# Altium schematic sheet 5VBoost.SchDoc
size A; SheetNumber: 2; SheetTotal: 4
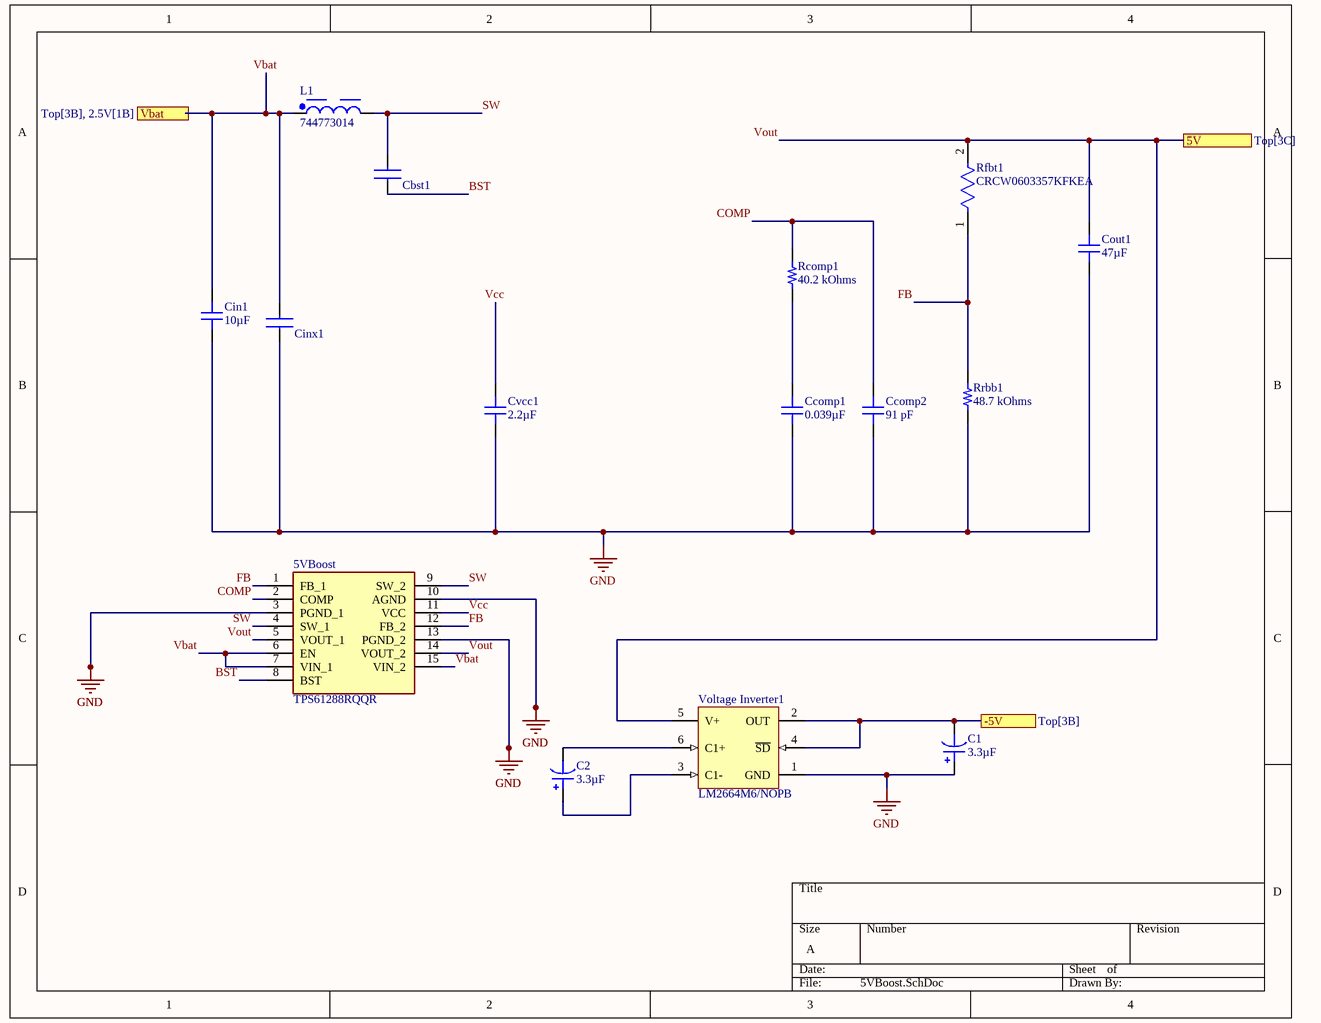
[diagram p0: 5VBoost.SchDoc]

## Parts
5VBoost  TPS61288RQQR  [TPS61288RQQR]
C1  value 3.3µF  [CAP POL 1411_3528]  (hidden comment: SCTB335K16)
C2  value 3.3µF  [CAP POL 1411_3528]  (hidden comment: SCTB335K16)
Cbst1  Capacitor 100nF 0603  [CAPC1608X90N]  (value not drawn)
Ccomp1  value 0.039µF  [CAP 0603_1608]  (hidden comment: 06035C393JAT2A)
Ccomp2  value 91 pF  [CAP 0603_1608]  (hidden comment: C0603C910J1GAC7867)
Cin1  value 10µF  [CAP 0603_1608]  (hidden comment: 06036D106KAT2A)
Cinx1  Capacitor 100nF 0603  [CAPC1608X90N]  (value not drawn)
Cout1  value 47µF  [CAP 0603_1608]  (hidden comment: 06036D476MAT2A)
Cvcc1  value 2.2µF  [CAP 0603_1608]  (hidden comment: 0603YD225KAT2A)
L1  744773014  [WE-PD2_4532]
Rcomp1  value 40.2 kOhms  [RES 0603_1608]  (hidden comment: RT0603DRE0740K2L)
Rfbt1  CRCW0603357KFKEA  [FP-CRCW0603-e3-IPC_C]
Rrbb1  value 48.7 kOhms  [RES 0603_1608]  (hidden comment: CPF0603F48K7C1)
Voltage_Inverter1  LM2664M6/NOPB  [DBV0006A_L]

## Ports
5V (see Top[3C]), -5V (see Top[3B]), Vbat (in, see Top[3B], 2.5V[1B])

## Nets
GND: 5VBoost.3(PGND_1) 5VBoost.10(AGND) 5VBoost.13(PGND_2) C1.1 Ccomp1.1 Ccomp2.1 Cin1.1 Cinx1.1 Cout1.1 Cvcc1.1 Rrbb1.1 Voltage_Inverter1.1(GND)
-5V: C1.2 Voltage_Inverter1.2(OUT) Voltage_Inverter1.4(~{SD}) ; port -5V
BST: 5VBoost.8(BST) Cbst1.1
COMP: 5VBoost.2(COMP) Ccomp2.2 Rcomp1.2
FB: 5VBoost.1(FB_1) 5VBoost.12(FB_2) Rfbt1.1 Rrbb1.2
SW: 5VBoost.4(SW_1) 5VBoost.9(SW_2) Cbst1.2 L1.2
Vbat: 5VBoost.6(EN) 5VBoost.7(VIN_1) 5VBoost.15(VIN_2) Cin1.2 Cinx1.2 L1.1 ; port Vbat
Vcc: 5VBoost.11(VCC) Cvcc1.2
Vout: 5VBoost.5(VOUT_1) 5VBoost.14(VOUT_2) Cout1.2 Rfbt1.2 Voltage_Inverter1.5(V+) ; port 5V
NetC2_1: C2.1 Voltage_Inverter1.3(C1-)
NetC2_2: C2.2 Voltage_Inverter1.6(C1+)
NetCcomp1_2: Ccomp1.2 Rcomp1.1

## Library data of the parts
5VBoost = TPS61288RQQR: Integrated Circuit; Manufacturer_Name: Texas Instruments; Datasheet Link: https://www.ti.com/lit/ds/symlink/tps61288.pdf?ts=1609351344517&ref_url=https%253A%252F%252Fwww.ti.com%252Fpower-management%252Fnon-isolated-dc-dc-switching-regulators%252Fstep-up-boost%252Fboost-converters-integrated-switch%252Fproducts.html; Height: 1mm; Manufacturer_Part_Number: TPS61288RQQR; Mouser Part Number: 595-TPS61288RQQR; Mouser Price/Stock: https://www.mouser.co.uk/ProductDetail/Texas-Instruments/TPS61288RQQR?qs=eP2BKZSCXI7ZX8saYJkaIw%3D%3D; Arrow Part Number: TPS61288RQQR; Arrow Price/Stock: https://www.arrow.com/en/products/tps61288rqqr/texas-instruments?utm_currency=USD&region=nac
C1 C2 = CMP-192-003656-1: CAP-TANT SM 3.3UF 16V; Manufacturer Size Code: B; manufacturer: NTE Electronics, Inc; Tolerance: ±10%; Type: Molded; series: SCT; Size / Dimension: 0.138" L x 0.110" W (3.50mm x 2.80mm); ComponentLink2URL: http://digikey.com/product-detail/en/nte-electronics-inc/SCTB335K16/2368-SCTB335K16-ND/11646299; lastupdated: 8/30/2020 8:55:00 PM; Features: General Purpose; price: 0.56; Mounting Type: Surface Mount; packaging: Bag; ComponentLink1URL: https://www.nteinc.com/capacitor_web/pdf/sct.pdf; partid: 3657; Minimum Order: 5; Height - Seated (Max): 0.083" (2.10mm); ComponentLink2Description: DigiKey Link; Package / Case: 1411 (3528 Metric), 1210; Part Number: SCTB335K16; Lifecycle Status: Active; ComponentLink1Description: Datasheet; Capacitance: 3.3µF
Cbst1 Cinx1 = CMP-002-000221-3: TDK - CGA3E2X7R1H104K080AA Multilayer Ceramic Capacitors MLCC - SMD/SMT CGA 0603 50V 0.1uF X7R 10% AEC-Q200; Manufacturer_Name: TDK; Datasheet Link: https://componentsearchengine.com//CGA3E2X7R1H104K080AA.pdf; Manufacturer_Part_Number: CGA3E2X7R1H104K080AA; Design Item ID: CGA3E2X7R1H104K080AA; Height: 0.9mm; Source: CGA3E2X7R1H104K080AA.SchLib; Mouser2 Price/Stock: https://www.mouser.com/Search/Refine.aspx?Keyword=810-CGA3E2X7R1H104K; Mouser2 Part Number: 810-CGA3E2X7R1H104K
Ccomp1 = CMP-184-000491-1: CAP CER 0.039UF 50V X7R 0603; manufacturer: AVX Corporation; Tolerance: ±5%; lastupdated: 9/2/2020 1:03:32 AM; Size / Dimension: 0.063" L x 0.032" W (1.60mm x 0.81mm); Part Status: Active; Lifecycle Status: Active; Package / Case: 0603 (1608 Metric); Voltage - Rated: 50V; ComponentLink2Description: DigiKey Link; Part Number: 06035C393JAT2A; ComponentLink2URL: http://digikey.com/product-detail/en/avx-corporation/06035C393JAT2A/478-10354-1-ND/6797293; Capacitance: 0.039µF; Device Package: 0603 (1608 Metric); Temperature Coefficient: X7R; Applications: General Purpose; partid: 4146; series: -; ComponentLink1URL: http://datasheets.avx.com/X7RDielectric.pdf; packaging: TapeAndReel; ComponentLink1Description: Datasheet; Operating Temperature: -55°C ~ 125°C; Thickness (Max): 0.035" (0.90mm); Minimum Order: 1; price: 0.08; Mounting Type: Surface Mount, MLCC
Ccomp2 = CMP-184-001276-1: CAP CER 91PF 100V C0G/NP0 0603; manufacturer: KEMET; Tolerance: ±5%; Temperature Coefficient: C0G, NP0; Lifecycle Status: Active; ComponentLink2URL: https://www.digikey.com/en/products/detail/kemet/C0603C910J1GAC7867/7382113; Mounting Type: Surface Mount, MLCC; ComponentLink2Description: DigiKey Link; Package / Case: 0603 (1608 Metric); series: SMD Comm C0G; ComponentLink1URL: https://api.kemet.com/component-edge/download/datasheet/C0603C910J1GAC7867.pdf; Part Status: Active; partid: 7603; price: 0.06; Minimum Order: 1; lastupdated: 9/19/2022 1:01:05 PM; Part Number: C0603C910J1GAC7867; Voltage - Rated: 100V; Size / Dimension: 0.063" L x 0.031" W (1.60mm x 0.80mm); Features: Low ESL; packaging: TapeAndReel; Capacitance: 91 pF; ComponentLink1Description: Datasheet; Operating Temperature: -55°C ~ 125°C; Applications: General Purpose; Device Package: 0603 (1608 Metric); Thickness (Max): 0.034" (0.87mm)
Cin1 = CMP-184-001573-1: CAP CER 10UF 6.3V X5R 0603; manufacturer: AVX Corporation; Tolerance: ±10%; Part Number: 06036D106KAT2A; lastupdated: 9/2/2020 1:03:24 AM; Voltage - Rated: 6.3V; Part Status: Active; price: 0.45; ComponentLink2URL: http://digikey.com/product-detail/en/avx-corporation/06036D106KAT2A/478-7932-1-ND/3881555; Size / Dimension: 0.063" L x 0.032" W (1.60mm x 0.81mm); ComponentLink1URL: http://datasheets.avx.com/cx5r.pdf; packaging: TapeAndReel; Device Package: 0603 (1608 Metric); partid: 8872; Thickness (Max): 0.035" (0.90mm); series: -; Minimum Order: 1; ComponentLink2Description: DigiKey Link; Capacitance: 10µF; Operating Temperature: -55°C ~ 85°C; Temperature Coefficient: X5R; Package / Case: 0603 (1608 Metric); Applications: General Purpose; ComponentLink1Description: Datasheet; Lifecycle Status: Active; Mounting Type: Surface Mount, MLCC
Cout1 = CMP-184-002058-1: CAP CER 47UF 6.3V X5R 0603; manufacturer: AVX Corporation; Tolerance: ±20%; Part Status: Active; Mounting Type: Surface Mount, MLCC; Minimum Order: 1; packaging: TapeAndReel; ComponentLink2URL: http://digikey.com/product-detail/en/avx-corporation/06036D476MAT2A/478-11180-1-ND/7563130; price: 0.41; lastupdated: 9/2/2020 1:03:20 AM; ComponentLink1URL: http://datasheets.avx.com/cx5r.pdf; Device Package: 0603 (1608 Metric); Voltage - Rated: 6.3V; series: -; ComponentLink2Description: DigiKey Link; ComponentLink1Description: Datasheet; partid: 11014; Size / Dimension: 0.063" L x 0.031" W (1.60mm x 0.80mm); Applications: General Purpose; Temperature Coefficient: X5R; Capacitance: 47µF; Operating Temperature: -55°C ~ 85°C; Part Number: 06036D476MAT2A; Package / Case: 0603 (1608 Metric); Lifecycle Status: Active
Cvcc1 = CMP-184-002158-1: CAP CER 2.2UF 16V X5R 0603; manufacturer: AVX Corporation; Tolerance: ±10%; Device Package: 0603 (1608 Metric); Package / Case: 0603 (1608 Metric); series: -; price: 0.19; Operating Temperature: -55°C ~ 85°C; Part Status: Active; Lifecycle Status: Active; packaging: TapeAndReel; Minimum Order: 1; ComponentLink2Description: DigiKey Link; Voltage - Rated: 16V; Part Number: 0603YD225KAT2A; ComponentLink1Description: Datasheet; partid: 11466; Applications: General Purpose; ComponentLink2URL: http://digikey.com/product-detail/en/avx-corporation/0603YD225KAT2A/478-5147-1-ND/1913237; Mounting Type: Surface Mount, MLCC; Temperature Coefficient: X5R; lastupdated: 9/2/2020 1:03:19 AM; ComponentLink1URL: http://datasheets.avx.com/cx5r.pdf; Thickness (Max): 0.035" (0.90mm); Capacitance: 2.2µF; Size / Dimension: 0.063" L x 0.032" W (1.60mm x 0.81mm)
L1 = CMP-0227-00478-2: NexarPartId: 24533326; Self Resonant Frequency: 103MHz; Inductance: 1.4µH; DC Resistance (DCR): 22mΩ; RMS Current (Irms): 3.4A; Inductance Tolerance: 20%; Saturation Current: 5.04A; Core Material: Ferrite; Test Frequency: 10kHz; Resistance: 56mΩ; Shielding: Unshielded; Min Operating Temperature: -40°C; Length: 4mm; Ambient Temperature Range Low: -40°C; Lead Free: Lead Free; Ambient Temperature Range High: 85°C; Case/Package: Nonstandard; REACH SVHC: Unknown; Width: 4.5mm; Max Operating Temperature: 125°C; Height: 3.2mm; Height - Seated (Max): 3.5052mm; RoHS: Compliant; Mount: Surface Mount; Tolerance: 20%; Composition: Wirewound; Current Rating: 3.4A; Max DC Current: 3.4A; Termination: SMD/SMT; Packaging: Digi-Reel®
Rcomp1 = CMP-289-002489-1: RES SMD 40.2KOHM 0.5% 1/10W 0603; Manufacturer: Yageo; Power (Watts): 0.1W, 1/10W; Temperature Coefficient: ±50ppm/°C; Supplier Device Package: 0603; Height - Seated (Max): 0.022" (0.55mm); Composition: Thin Film; Size / Dimension: 0.063" L x 0.031" W (1.60mm x 0.80mm); Packaging: TapeAndReel; Series: RT; Resistance: 40.2 kOhms; Minimum Order: 1; PartId: 9988; ComponentLink1URL: https://www.yageo.com/upload/media/product/productsearch/datasheet/rchip/PYu-RT_1-to-0.01_RoHS_L_11.pdf; Number of Terminations: 2; Part Number: RT0603DRE0740K2L; Device Package: 0603 (1608 Metric); Price: 0.01; Operating Temperature: -55°C ~ 155°C; ComponentLink2Description: DigiKey Link; Tolerance: ±0.5%; Part Status: Active; ComponentLink2URL: https://www.digikey.com/en/products/detail/yageo/RT0603DRE0740K2L/1074850; LastUpdated: 9/19/2022 1:22:15 PM; Lifecycle Status: Active; ComponentLink1Description: Datasheet; Package / Case: 0603 (1608 Metric)
Rfbt1 = CMP-2000-03262-2: RES Thick Film, 357kΩ, 1%, 0.1W, 100ppm/°C, 0603; Max Power Dissipation: 100mW; Voltage Rating (DC): 75V; Resistance: 357kR; Packaging: Tape and Reel; Min Operating Temperature: -55°C; Max Operating Temperature: 155°C; Number of Pins: 2; Length: 1.55mm; Case Code (Imperial): 0603; Number of Terminations: 2; Military Standard: Not; Width: 0.033inch; Case Code (Metric): 1608; Termination: Solder; Radiation Hardening: No; Power Rating: 100mW; Depth: 0.85mm; Voltage Rating: 75V; Height: 0.45mm; Case/Package: 0603; Package Quantity: 10; Composition: Thick Film; Weight: 7.1E-05oz; Features: Automotive AEC-Q200; Lead Free: Lead Free; Tolerance: 1%; Temperature Coefficient: 100ppm/°C; Contact Plating: Tin
Rrbb1 = CMP-289-001065-1: RES SMD 48.7K OHM 1% 1/16W 0603; Manufacturer: TE Connectivity Passive Product; Temperature Coefficient: ±50ppm/°C; Power (Watts): 0.063W, 1/16W; ComponentLink2Description: DigiKey Link; ComponentLink1Description: Datasheet; Tolerance: ±1%; PartId: 7053; Composition: Thin Film; Size / Dimension: 0.061" L x 0.031" W (1.55mm x 0.80mm); Operating Temperature: -55°C ~ 155°C; LastUpdated: 9/19/2022 1:22:26 PM; Part Number: CPF0603F48K7C1; Resistance: 48.7 kOhms; Price: 0.02; Part Status: Active; Height - Seated (Max): 0.022" (0.55mm); Device Package: 0603 (1608 Metric); Series: CPF, Neohm; Package / Case: 0603 (1608 Metric); Number of Terminations: 2; Minimum Order: 1; Lifecycle Status: Active; Packaging: TapeAndReel; Supplier Device Package: 0603; ComponentLink2URL: https://www.digikey.com/en/products/detail/te-connectivity-passive-product/CPF0603F48K7C1/2384648; ComponentLink1URL: https://www.te.com/commerce/DocumentDelivery/DDEController?Action=srchrtrv&DocNm=1773200&DocType=DS&DocLang=English
Voltage_Inverter1 = CMP-0065-00094-3: Switched Capacitor Voltage Converter, 6-pin SOT-23, Pb-Free; Manufacturer: Texas Instruments; PackageTopMarking: S03A*XTT; CompType: Switch Caps; PowerWise: N; PackageDescription: Molded SOT-23, .115 x .063 x .040in Body, 6 Lead, .0375in in Pitch; PackageReference: DBV0006A; ComponentLink1URL: http://www.ti.com/general/docs/lit/getliterature.tsp?genericPartNumber=LM2664&fileType=pdf; ComponentLink1Description: Datasheet URL; Code_IPC: SOT26A-6; RoHS: Y; PinCount: 6; Code_JEDEC: MO-178-AB